# EAGLE design i2-mb_rpi (EAGLE 6.1)
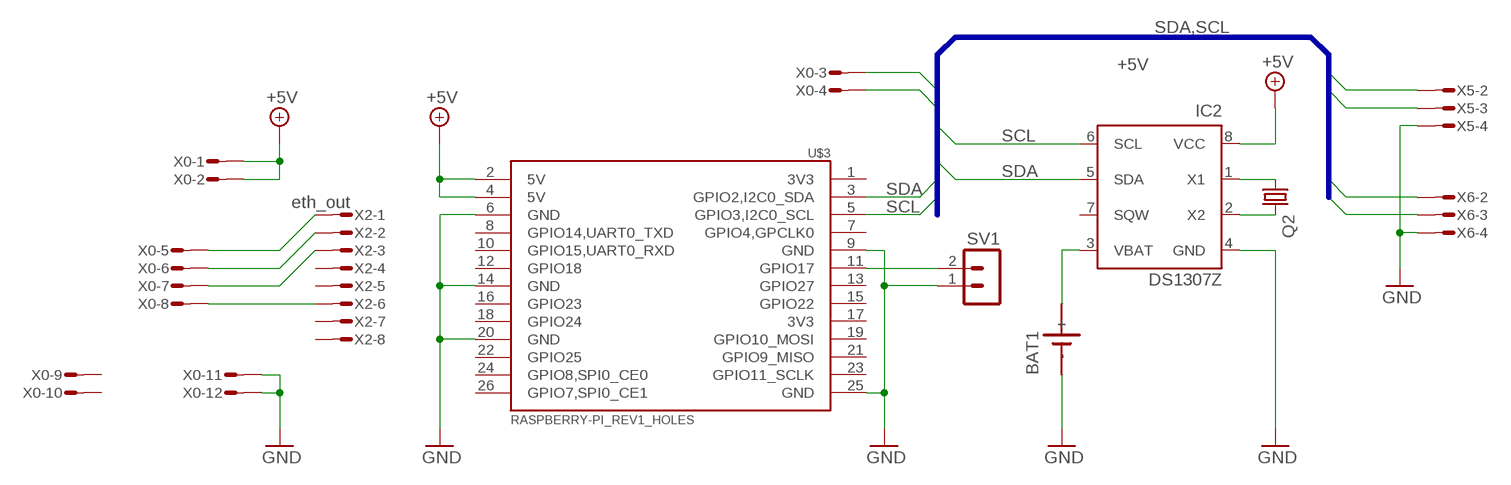
[diagram p0: schematic, sheet 1]

## Parts
BAT1  SN2032  [SN2032]
IC2  DS1307Z  [SOIC8]
Q2  CRYSTAL  [CFPX-217]
SV1  MA02-1  [MA03-1]
U$3  RASPBERRY-PI_REV1_HOLES  [RASPBERRY-PI_REV1_HOLES]
X0  MICROMATCH-12  [MICROMATCH-12]
X2  eth_out  MICROMATCH-8  [MICROMATCH-8]
X5  i2c#1  MICROMATCH-4  [MICROMATCH-4]
X6  i2c#2  MICROMATCH-4  [MICROMATCH-4]

## Nets
+5V: IC2.8(VCC) U$3.2(5V) U$3.4(5V) X0.1 X0.2
GND: BAT1.- IC2.4(GND) SV1.1 U$3.6(GND) U$3.9(GND) U$3.14(GND) U$3.20(GND) U$3.25(GND) X0.11 X0.12 X5.4 X6.4
N$1: BAT1.+ IC2.3(VBAT)
N$2: SV1.2 U$3.11(GPIO17)
N$3: X0.5 X2.1
N$4: X0.6 X2.2
N$5: X0.7 X2.3
N$6: IC2.1(X1) Q2.1
N$7: X0.8 X2.6
N$9: IC2.2(X2) Q2.2
SCL: IC2.6(SCL) U$3.5(GPIO3,I2C0_SCL) X0.4 X5.3 X6.3
SDA: IC2.5(SDA) U$3.3(GPIO2,I2C0_SDA) X0.3 X5.2 X6.2
Unconnected: IC2.7(SQW) U$3.1(3V3) U$3.7(GPIO4,GPCLK0) U$3.8(GPIO14,UART0_TXD) U$3.10(GPIO15,UART0_RXD) U$3.12(GPIO18) U$3.13(GPIO27) U$3.15(GPIO22) U$3.16(GPIO23) U$3.17(3V3) U$3.18(GPIO24) U$3.19(GPIO10_MOSI) U$3.21(GPIO9_MISO) U$3.22(GPIO25) U$3.23(GPIO11_SCLK) U$3.24(GPIO8,SPI0_CE0) U$3.26(GPIO7,SPI0_CE1) X0.9 X0.10 X2.4 X2.5 X2.7 X2.8 X5.1 X6.1

## Buses
SDA,SCL

## Library data of the parts
BAT1 = sn2032:SN2032: LI BATTERY
IC2 = ds1307_pcf8583:DS1307: I2C-Bus CLOCK/CALENDAR
Q2 = wb:CRYSTAL: CRYSTAL
SV1 = wb:MA02-1: PIN HEADER; OC_FARNELL: unknown; OC_NEWARK: unknown
U$3 = RaspberryPi:RASPBERRY-PI_REV1_HOLES: Raspberry Pi Board <http://www.raspberrypi.org/> Jacques Lagnel V1.0 (beta) 2012 Mateusz Bawaj V1.1 (beta) 2012 Board dimension: Forum 3D model <http://www.raspberrypi.org/forum/general-discussion/mechanical-profile-3d-models?value=3d%20model&type=1&include=1&search=1&ret=all> The GPIO Connector (P1): http://elinux.org/RPi_Low-level_peripherals The GPIO Connector (P5): http://www.raspberrypi-spy.co.uk/2012/09/raspberry-pi-p5-header/
X0 = con-maritex:MICROMATCH-12: MicroMaTch 12 8-215464-2 / 1-215464-2 Drawing Number C-215464 DDEController.pdf
X2 = con-maritex:MICROMATCH-8: MicroMaTch 8 7-215464-8 / 0-215464-8 Drawing Number C-215464 DDEController.pdf
X5 X6 = con-maritex:MICROMATCH-4: MicroMaTch 4 7-215464-4 / 0-215464-4 Drawing Number C-215464 DDEController.pdf

## Board
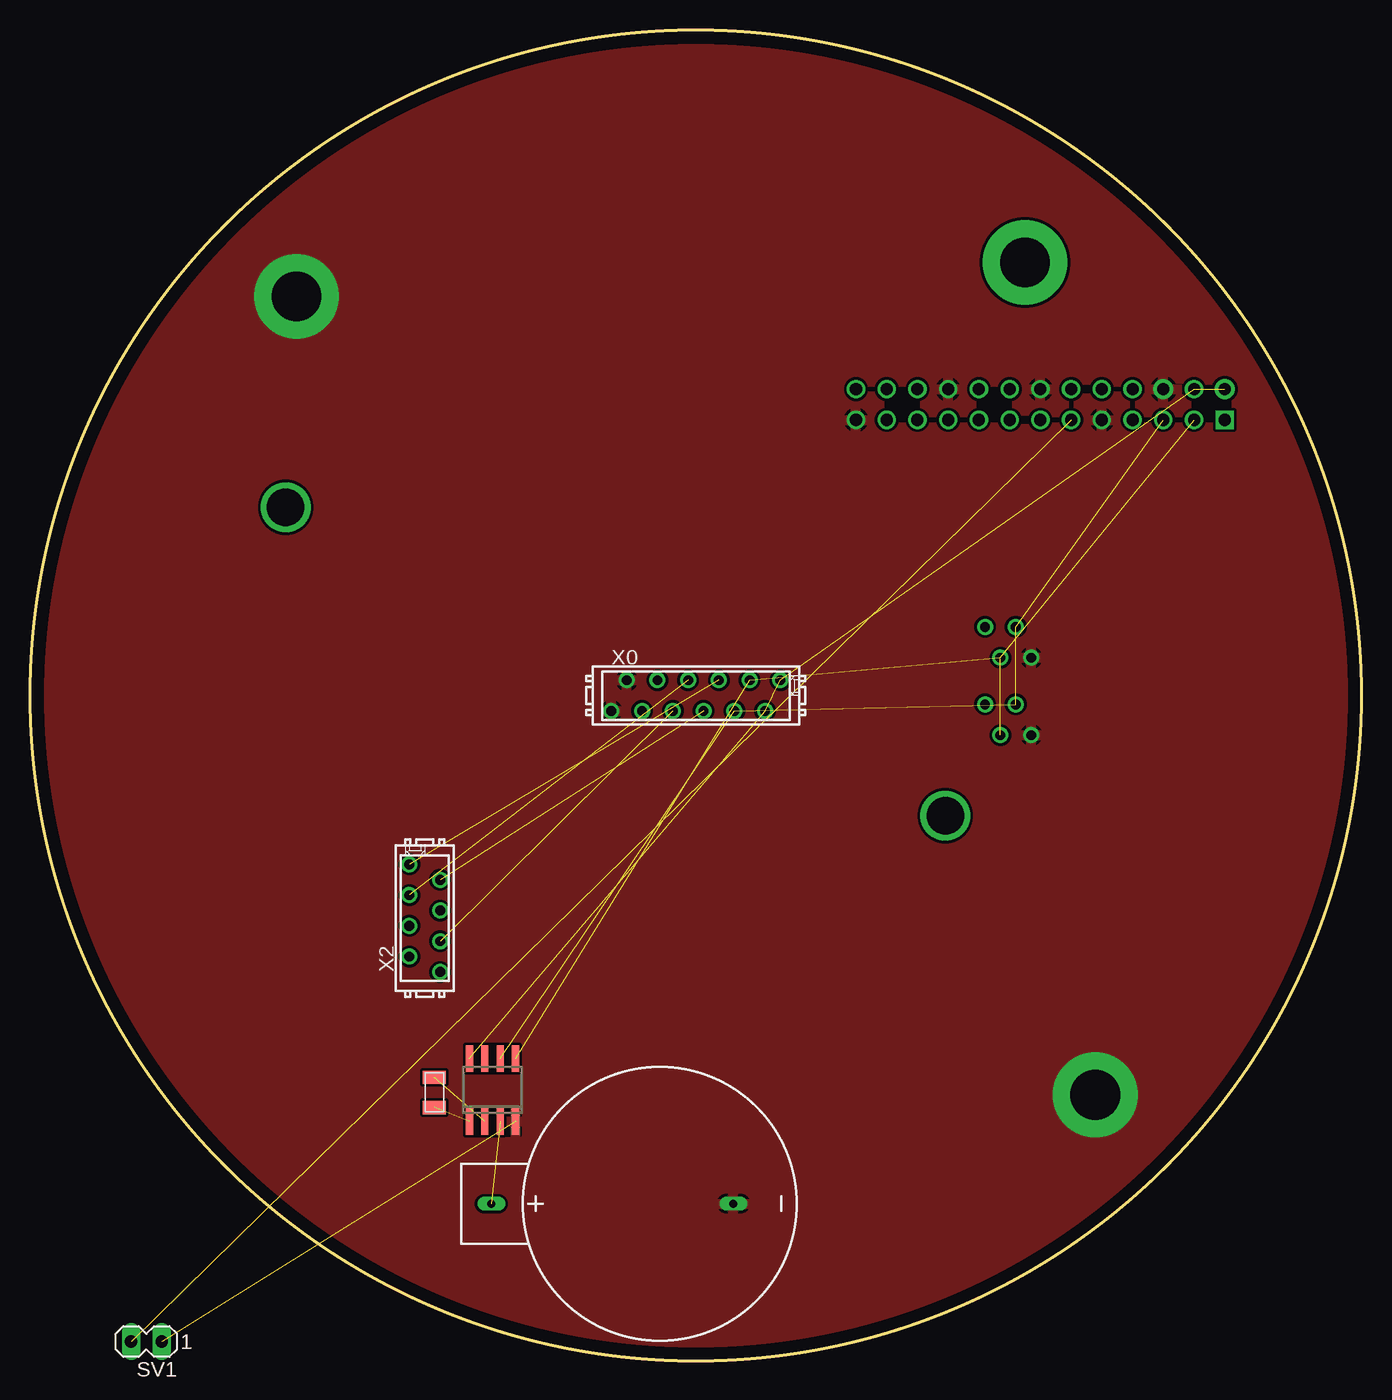
[diagram p1: board, top side]
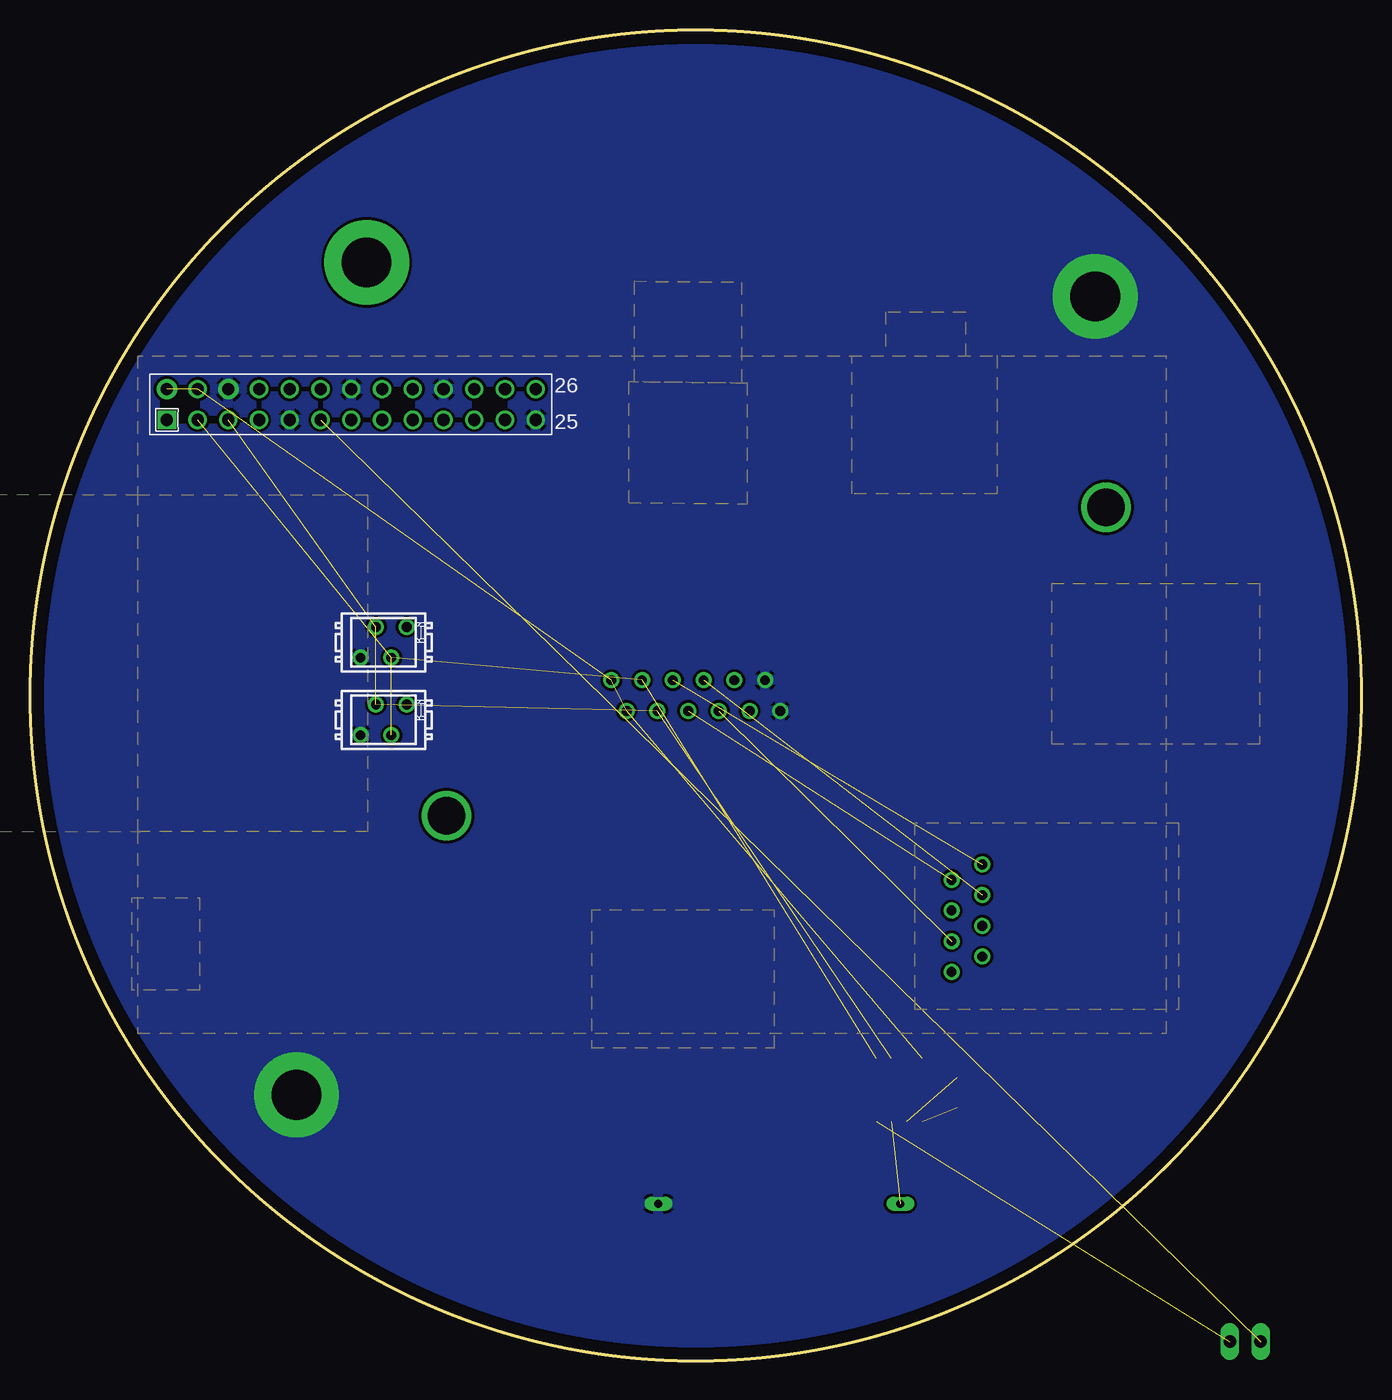
[diagram p2: board, bottom side, seen from below]

Size 110 x 110 mm. Coordinates in mm from the lower left corner, seen from the top.
Outline: circle at 55,55 radius 55
Copper layers (1*16): Top 0.035mm / dielectric 1.5mm / Bottom 0.035mm
Design rules: minimum track width 10mil, minimum drill 24mil, track to track 9mil, track to pad 9mil, pad to pad 9mil, via to via 9mil, smd to smd 9mil, copper to edge 40mil, drill to drill 8mil, minimum pad ring 10mil, minimum via ring 8mil, stop-mask expansion 4mil, vias tented up to drill 0mil, thermal gap 10mil

### Footprints (pad centres in the part's own frame; a part is rotated, then mirrored left to right if it is on the bottom)
SN2032 = drill 0.65 long: + 0,13.9; - 0,-6.1
SOIC8 = smd 0.6 x 2.2: 1 -1.905,-2.6; 2 -0.635,-2.6; 3 0.635,-2.6; 4 1.905,-2.6; 5 1.905,2.6; 6 0.635,2.6; 7 -0.635,2.6; 8 -1.905,2.6
CFPX-217 = smd 1.1 x 1.9: 1 -1.25,0; 2 1.25,0
MA03-1 = drill 1.016 long: 1 -1.27,0; 2 1.27,0
RASPBERRY-PI_REV1_HOLES = drill 1 square: 1 -41.91,21.59 | drill 1 pad 1.676: 2 -41.91,24.13; 6 -36.83,24.13 | drill 1: 3 -39.37,21.59; 4 -39.37,24.13; 5 -36.83,21.59; 7 -34.29,21.59; 8 -34.29,24.13; 9 -31.75,21.59; 10 -31.75,24.13; 11 -29.21,21.59; 12 -29.21,24.13; 13 -26.67,21.59; 14 -26.67,24.13; 15 -24.13,21.59; 16 -24.13,24.13; 17 -21.59,21.59; 18 -21.59,24.13; 19 -19.05,21.59; 20 -19.05,24.13; 21 -16.51,21.59; 22 -16.51,24.13; 23 -13.97,21.59; 24 -13.97,24.13; 25 -11.43,21.59; 26 -11.43,24.13 | drill 3.1: P$1 -18.81,-11.135; P$2 35.69,14.365
MICROMATCH-12 = drill 0.813: 1 6.985,1.27; 2 5.715,-1.27; 3 4.445,1.27; 4 3.175,-1.27; 5 1.905,1.27; 6 0.635,-1.27; 7 -0.635,1.27; 8 -1.905,-1.27; 9 -3.175,1.27; 10 -4.445,-1.27; 11 -5.715,1.27; 12 -6.985,-1.27
MICROMATCH-8 = drill 0.813: 1 4.445,1.27; 2 3.175,-1.27; 3 1.905,1.27; 4 0.635,-1.27; 5 -0.635,1.27; 6 -1.905,-1.27; 7 -3.175,1.27; 8 -4.445,-1.27
MICROMATCH-4 = drill 0.813: 1 1.905,1.27; 2 0.635,-1.27; 3 -0.635,1.27; 4 -1.905,-1.27

### Placement (x,y rotation side)
BAT1  52,13 90 top
IC2  38.2,22.4 0 top
Q2  33.4,22.2 90 top
SV1  9.6,1.6 180 top
U$3  56.8,56.2 0 bottom
X0  55,55 0 top
X2  32.6,36.6 90 top
X5  80.8,59.4 0 bottom
X6  80.8,53 0 bottom

### Tracks (layer width: path | path; a pad name or v marks a point on that pad's centre or on a via)
+5V  (4 unrouted)
+12V  (via drill 4.1 pad 7)
  other vias: 82.2,90.8
GND  (via drill 4.1 pad 7)  (1 unrouted)
  other vias: 22,88 88,22
  pour Top: 0,55 arc-90 55,110 arc-90 110,55 arc-90 55,0 arc-90 0,54.8
  pour Bottom: 0,55 arc-90 55,110 arc-90 110,55 arc-90 55,0 arc-90 0,54.8
N$1  (1 unrouted)
N$2  (1 unrouted)
N$3  (1 unrouted)
N$4  (1 unrouted)
N$5  (1 unrouted)
N$6  (1 unrouted)
N$7  (1 unrouted)
N$9  (1 unrouted)
SCL  (4 unrouted)
SDA  (4 unrouted)